# Altium schematic sheet T35_2_POWER_CONFIG.SchDoc
size A3
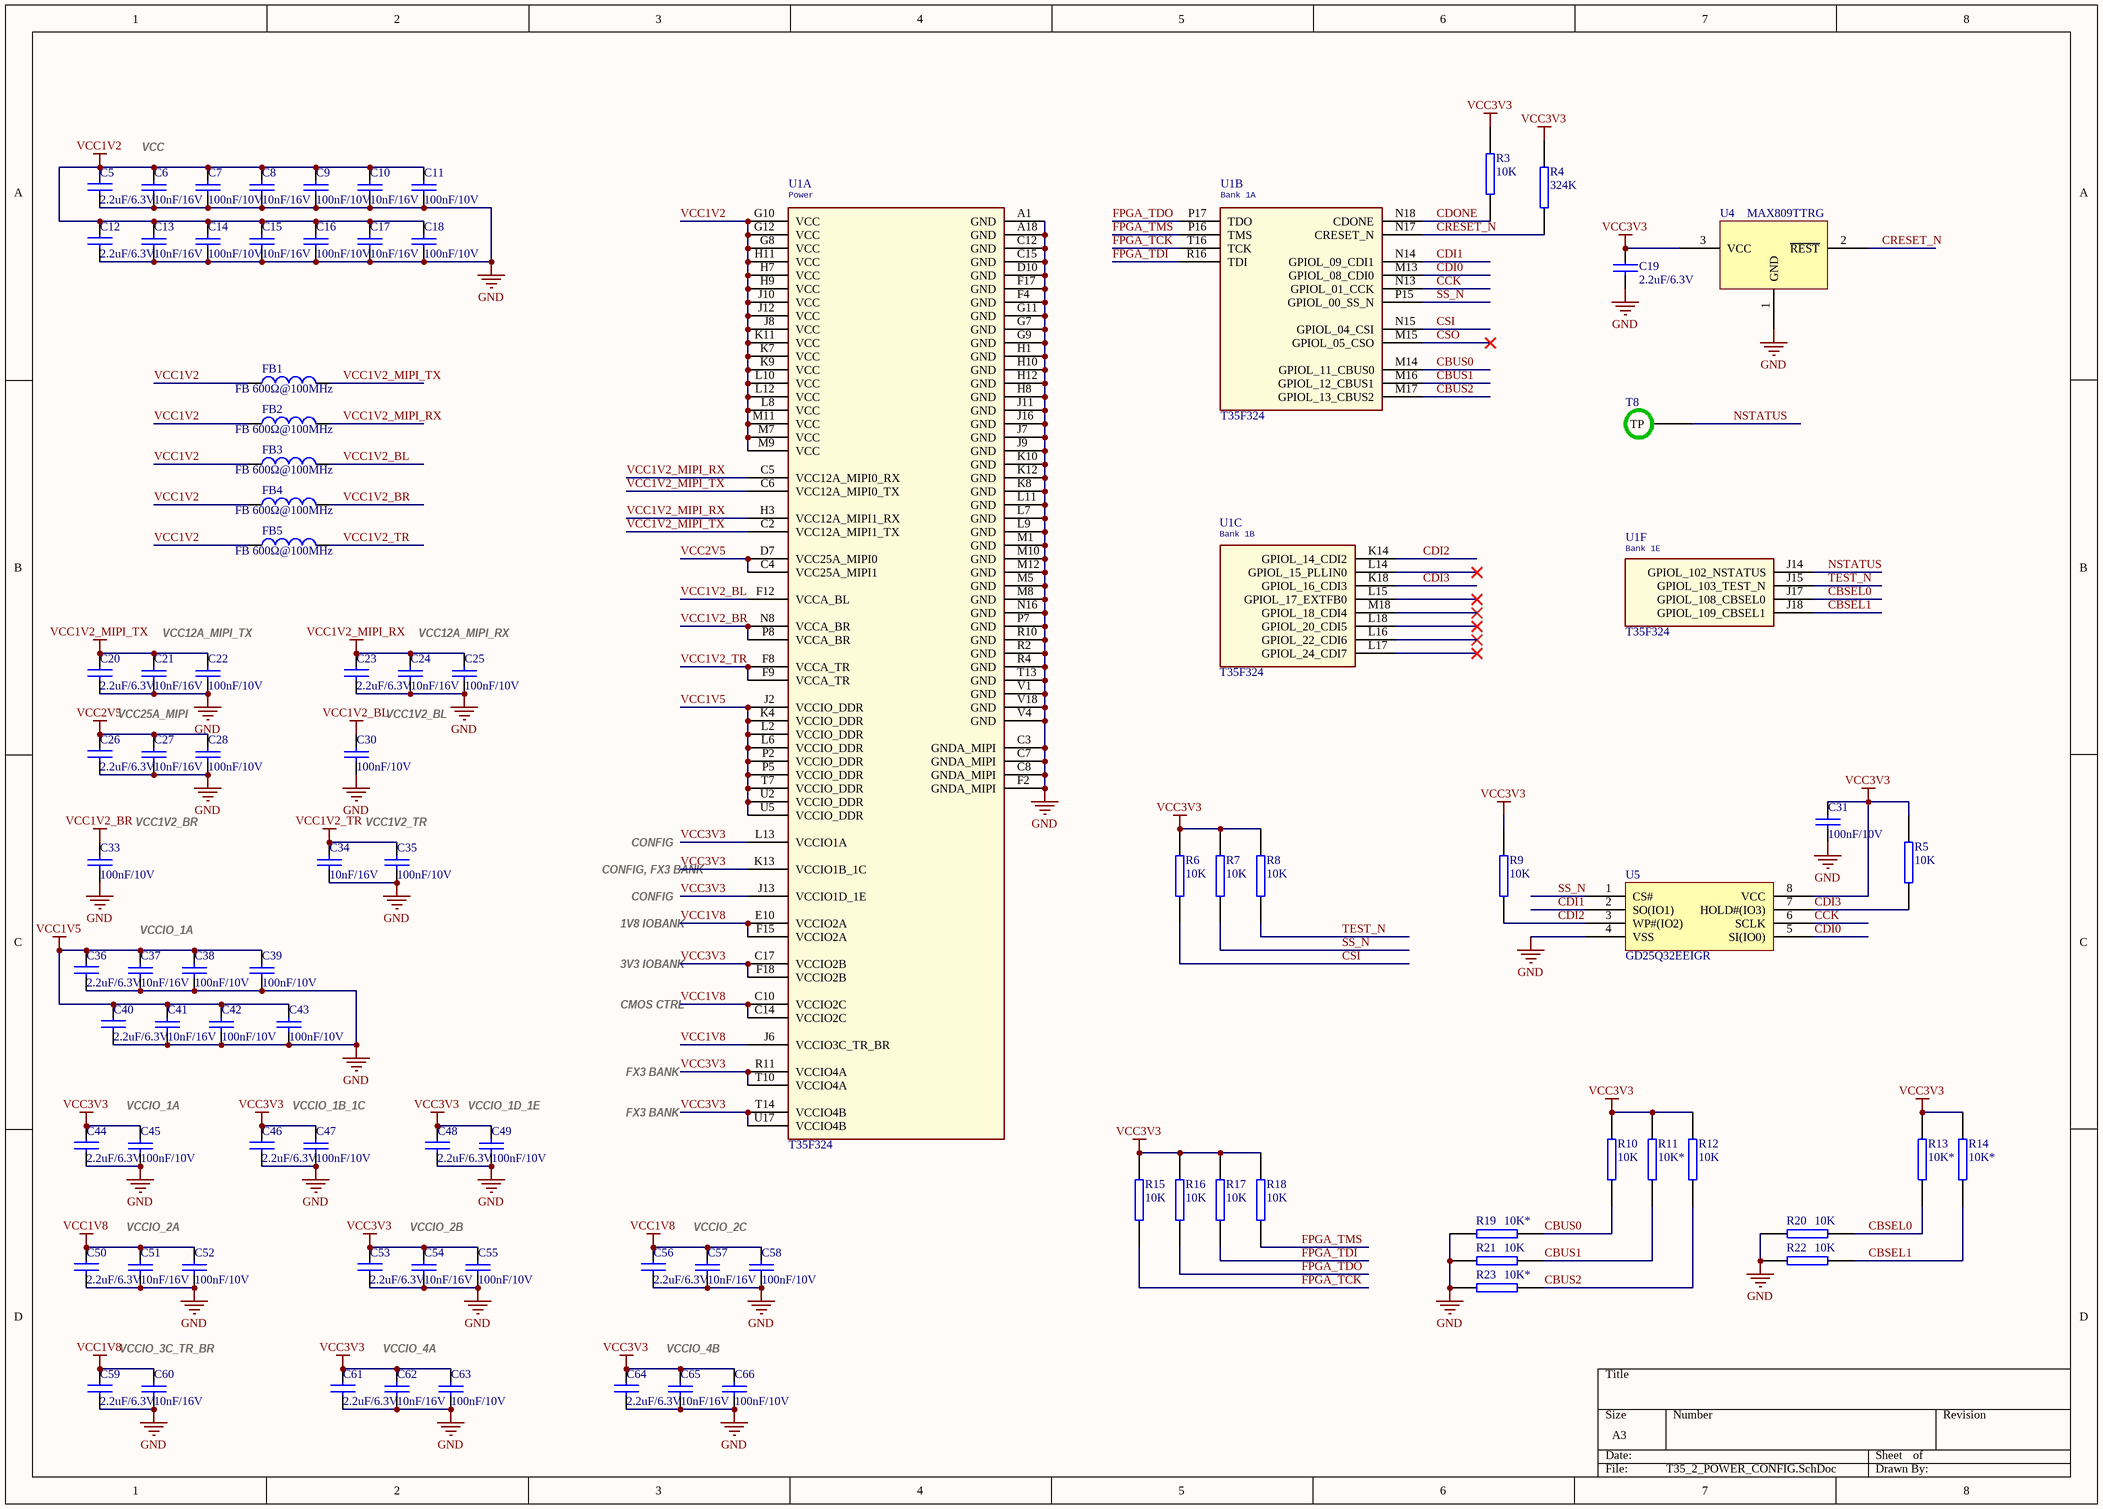
[diagram p0: T35_2_POWER_CONFIG.SchDoc]

## Parts
C5  2.2uF/6.3V  [0201CS]
C6  10nF/16V  [0201CS]
C7  100nF/10V  [0201CS]
C8  10nF/16V  [0201CS]
C9  100nF/10V  [0201CS]
C10  10nF/16V  [0201CS]
C11  100nF/10V  [0201CS]
C12  2.2uF/6.3V  [0201CS]
C13  10nF/16V  [0201CS]
C14  100nF/10V  [0201CS]
C15  10nF/16V  [0201CS]
C16  100nF/10V  [0201CS]
C17  10nF/16V  [0201CS]
C18  100nF/10V  [0201CS]
C19  2.2uF/6.3V  [0201CS]
C20  2.2uF/6.3V  [0201CS]
C21  10nF/16V  [0201CS]
C22  100nF/10V  [0201CS]
C23  2.2uF/6.3V  [0201CS]
C24  10nF/16V  [0201CS]
C25  100nF/10V  [0201CS]
C26  2.2uF/6.3V  [0201CS]
C27  10nF/16V  [0201CS]
C28  100nF/10V  [0201CS]
C30  100nF/10V  [0201CS]
C31  100nF/10V  [0201CS]
C33  100nF/10V  [0201CS]
C34  10nF/16V  [0201CS]
C35  100nF/10V  [0201CS]
C36  2.2uF/6.3V  [0201CS]
C37  10nF/16V  [0201CS]
C38  100nF/10V  [0201CS]
C39  100nF/10V  [0201CS]
C40  2.2uF/6.3V  [0201CS]
C41  10nF/16V  [0201CS]
C42  100nF/10V  [0201CS]
C43  100nF/10V  [0201CS]
C44  2.2uF/6.3V  [0201CS]
C45  100nF/10V  [0201CS]
C46  2.2uF/6.3V  [0201CS]
C47  100nF/10V  [0201CS]
C48  2.2uF/6.3V  [0201CS]
C49  100nF/10V  [0201CS]
C50  2.2uF/6.3V  [0201CS]
C51  10nF/16V  [0201CS]
C52  100nF/10V  [0201CS]
C53  2.2uF/6.3V  [0201CS]
C54  10nF/16V  [0201CS]
C55  100nF/10V  [0201CS]
C56  2.2uF/6.3V  [0201CS]
C57  10nF/16V  [0201CS]
C58  100nF/10V  [0201CS]
C59  2.2uF/6.3V  [0201CS]
C60  10nF/16V  [0201CS]
C61  2.2uF/6.3V  [0201CS]
C62  10nF/16V  [0201CS]
C63  100nF/10V  [0201CS]
C64  2.2uF/6.3V  [0201CS]
C65  10nF/16V  [0201CS]
C66  100nF/10V  [0201CS]
FB1  FB 600Ω@100MHz  [FB0603]
FB2  FB 600Ω@100MHz  [FB0603]
FB3  FB 600Ω@100MHz  [FB0603]
FB4  FB 600Ω@100MHz  [FB0603]
FB5  FB 600Ω@100MHz  [FB0603]
R3  10K  [0201RS]
R4  324K  [0402RS]
R5  10K  [0201RS]
R6  10K  [0201RS]
R7  10K  [0201RS]
R8  10K  [0201RS]
R9  10K  [0201RS]
R10  10K  [0201RS]
R11  10K*  [0201RS]
R12  10K  [0201RS]
R13  10K*  [0201RS]
R14  10K*  [0201RS]
R15  10K  [0201RS]
R16  10K  [0201RS]
R17  10K  [0201RS]
R18  10K  [0201RS]
R19  10K*  [0201RS]
R20  10K  [0201RS]
R21  10K  [0201RS]
R22  10K  [0201RS]
R23  10K*  [0201RS]
T8  (no value)  [TP-S]
U1  T35F324  [T35-F324-BGA100P9X9-81A]  (parts A,B,C,F of 17)
U4  MAX809TTRG  [MAX809]
U5  GD25Q32EEIGR  [SON127P600-8N-USON8]

## Nets
GND: C5.2 C6.2 C7.2 C8.2 C9.2 C10.2 C11.2 C12.2 C13.2 C14.2 C15.2 C16.2 C17.2 C18.2 C19.2 C20.2 C21.2 C22.2 C23.2 C24.2 C25.2 C26.2 C27.2 C28.2 C30.2 C31.2 C33.2 C34.2 C35.2 C36.2 C37.2 C38.2 C39.2 C40.2 C41.2 C42.2 C43.2 C44.2 C45.2 C46.2 C47.2 C48.2 C49.2 C50.2 C51.2 C52.2 C53.2 C54.2 C55.2 C56.2 C57.2 C58.2 C59.2 C60.2 C61.2 C62.2 C63.2 C64.2 C65.2 C66.2 R19.1 R20.1 R21.1 R22.1 R23.1 U1.A1(GND) U1.A18(GND) U1.C3(GNDA_MIPI) U1.C7(GNDA_MIPI) U1.C8(GNDA_MIPI) U1.C12(GND) U1.C15(GND) U1.D10(GND) U1.F2(GNDA_MIPI) U1.F4(GND) U1.F17(GND) U1.G7(GND) U1.G9(GND) U1.G11(GND) U1.H1(GND) U1.H8(GND) U1.H10(GND) U1.H12(GND) U1.J7(GND) U1.J9(GND) U1.J11(GND) U1.J16(GND) U1.K8(GND) U1.K10(GND) U1.K12(GND) U1.L7(GND) U1.L9(GND) U1.L11(GND) U1.M1(GND) U1.M5(GND) U1.M8(GND) U1.M10(GND) U1.M12(GND) U1.N16(GND) U1.P7(GND) U1.R2(GND) U1.R4(GND) U1.R10(GND) U1.T13(GND) U1.V1(GND) U1.V4(GND) U1.V18(GND) U4.1(GND) U5.4(VSS)
VCC1V2: C5.1 C6.1 C7.1 C8.1 C9.1 C10.1 C11.1 C12.1 C13.1 C14.1 C15.1 C16.1 C17.1 C18.1 FB1.1 FB2.1 FB3.1 FB4.1 FB5.1 U1.G8(VCC) U1.G10(VCC) U1.G12(VCC) U1.H7(VCC) U1.H9(VCC) U1.H11(VCC) U1.J8(VCC) U1.J10(VCC) U1.J12(VCC) U1.K7(VCC) U1.K9(VCC) U1.K11(VCC) U1.L8(VCC) U1.L10(VCC) U1.L12(VCC) U1.M7(VCC) U1.M9(VCC) U1.M11(VCC)
VCC1V2_BL: C30.1 FB3.2 U1.F12(VCCA_BL)
VCC1V2_BR: C33.1 FB4.2 U1.N8(VCCA_BR) U1.P8(VCCA_BR)
VCC1V2_MIPI_RX: C23.1 C24.1 C25.1 FB2.2 U1.C5(VCC12A_MIPI0_RX) U1.H3(VCC12A_MIPI1_RX)
VCC1V2_MIPI_TX: C20.1 C21.1 C22.1 FB1.2 U1.C2(VCC12A_MIPI1_TX) U1.C6(VCC12A_MIPI0_TX)
VCC1V2_TR: C34.1 C35.1 FB5.2 U1.F8(VCCA_TR) U1.F9(VCCA_TR)
VCC1V5: C36.1 C37.1 C38.1 C39.1 C40.1 C41.1 C42.1 C43.1 U1.J2(VCCIO_DDR) U1.K4(VCCIO_DDR) U1.L2(VCCIO_DDR) U1.L6(VCCIO_DDR) U1.P2(VCCIO_DDR) U1.P5(VCCIO_DDR) U1.T7(VCCIO_DDR) U1.U2(VCCIO_DDR) U1.U5(VCCIO_DDR)
VCC1V8: C50.1 C51.1 C52.1 C56.1 C57.1 C58.1 C59.1 C60.1 U1.C10(VCCIO2C) U1.C14(VCCIO2C) U1.E10(VCCIO2A) U1.F15(VCCIO2A) U1.J6(VCCIO3C_TR_BR)
VCC2V5: C26.1 C27.1 C28.1 U1.C4(VCC25A_MIPI1) U1.D7(VCC25A_MIPI0)
VCC3V3: C19.1 C31.1 C44.1 C45.1 C46.1 C47.1 C48.1 C49.1 C53.1 C54.1 C55.1 C61.1 C62.1 C63.1 C64.1 C65.1 C66.1 R3.1 R4.1 R5.2 R6.1 R7.1 R8.1 R9.2 R10.1 R11.1 R12.1 R13.1 R14.1 R15.1 R16.1 R17.1 R18.1 U1.C17(VCCIO2B) U1.F18(VCCIO2B) U1.J13(VCCIO1D_1E) U1.K13(VCCIO1B_1C) U1.L13(VCCIO1A) U1.R11(VCCIO4A) U1.T10(VCCIO4A) U1.T14(VCCIO4B) U1.U17(VCCIO4B) U4.3(VCC) U5.8(VCC)
CBSEL0: R13.2 R20.2 U1.J17(GPIOL_108_CBSEL0)
CBSEL1: R14.2 R22.2 U1.J18(GPIOL_109_CBSEL1)
CBUS0: R10.2 R19.2 U1.M14(GPIOL_11_CBUS0)
CBUS1: R11.2 R21.2 U1.M16(GPIOL_12_CBUS1)
CBUS2: R12.2 R23.2 U1.M17(GPIOL_13_CBUS2)
CCK: U1.N13(GPIOL_01_CCK) U5.6(SCLK)
CDI0: U1.M13(GPIOL_08_CDI0) U5.5(SI(IO0))
CDI1: U1.N14(GPIOL_09_CDI1) U5.2(SO(IO1))
CDI2: R9.1 U1.K14(GPIOL_14_CDI2) U5.3(WP#(IO2))
CDI3: R5.1 U1.K18(GPIOL_16_CDI3) U5.7(HOLD#(IO3))
CDONE: R3.2 U1.N18(CDONE)
CRESET_N: R4.2 U1.N17(CRESET_N) U4.2(~{REST})
CSI: R6.2 U1.N15(GPIOL_04_CSI)
CSO: U1.M15(GPIOL_05_CSO)
FPGA_TCK: R15.2 U1.T16(TCK)
FPGA_TDI: R17.2 U1.R16(TDI)
FPGA_TDO: R16.2 U1.P17(TDO)
FPGA_TMS: R18.2 U1.P16(TMS)
NSTATUS: T8.1(TP) U1.J14(GPIOL_102_NSTATUS)
SS_N: R7.2 U1.P15(GPIOL_00_SS_N) U5.1(CS#)
TEST_N: R8.2 U1.J15(GPIOL_103_TEST_N)

Not connected (* = marked no-connect by the designer): U1 L14(GPIOL_15_PLLIN0)* L15(GPIOL_17_EXTFB0)* L16(GPIOL_22_CDI6)* L17(GPIOL_24_CDI7)* L18(GPIOL_20_CDI5)* M18(GPIOL_18_CDI4)*

## Notes on the sheet
- (near C6) VCC
- VCC12A_MIPI_TX
- VCC12A_MIPI_RX
- VCC25A_MIPI
- VCC1V2_BL
- VCC1V2_BR
- (near C35) VCC1V2_TR
- CONFIG
- CONFIG, FX3 BANK
- 1V8 IOBANK
- VCCIO_1A
- 3V3 IOBANK
- CMOS CTRL
- (near C45) VCCIO_1A
- VCCIO_1B_1C
- VCCIO_1D_1E
- FX3 BANK
- VCCIO_2A
- VCCIO_2B
- VCCIO_2C
- VCCIO_3C_TR_BR
- VCCIO_4A
- VCCIO_4B
- (in symbol T35F324, part A) Power
- (in symbol T35F324, part B) Bank 1A
- (in symbol T35F324, part C) Bank 1B
- (in symbol T35F324, part F) Bank 1E

## Library data of the parts
C5 C12 C19 C20 C23 C26 C36 C40 C44 C46 C48 C50 C53 C56 C59 C61 C64 = CAPACITOR NON-POL: 贴片电容; Link: https://item.szlcsc.com/359940.html
C6-C11 C13-C18 C21 C22 C24 C25 C27 C28 C30 C33-C35 C37-C39 C41-C43 C45 C47 C49 C51 C52 C54 C55 C57 C58 C60 C62 C63 C65 C66 = CAP: 贴片电容
  C6 C8 C10 C13 C15 C17 C21 C24 C27 C34 C37 C41 C51 C54 C57 C60 C62 C65: Link: https://item.szlcsc.com/78065.html
  C7 C9 C11 C14 C16 C18 C22 C25 C28 C30 C33 C35 C38 C39 C42 C43 C45 C47 C49 C52 C55 C58 C63 C66: Link: https://item.szlcsc.com/456838.html
C31 = CAP: 贴片电容; Value: 0.1uF ±10% 16V; Link: https://item.szlcsc.com/456838.html
FB1-FB5 = Inductor: 贴片磁珠; Link: https://item.szlcsc.com/948048.html
R3-R23 = RES2: 贴片电阻
T8 = TP: 测试点
U1 = T35F324: FPGA芯片; SWAP_INFO: (S1+S2+S3+S4+S5+S6+S7+S8+S9+S10+S11+S12+S13+S14+S15+S16+S17); SPLIT_INST: TRUE
U4 = MAX809: 复位芯片
U5 = GD25Q64ESIG: SPI Flash